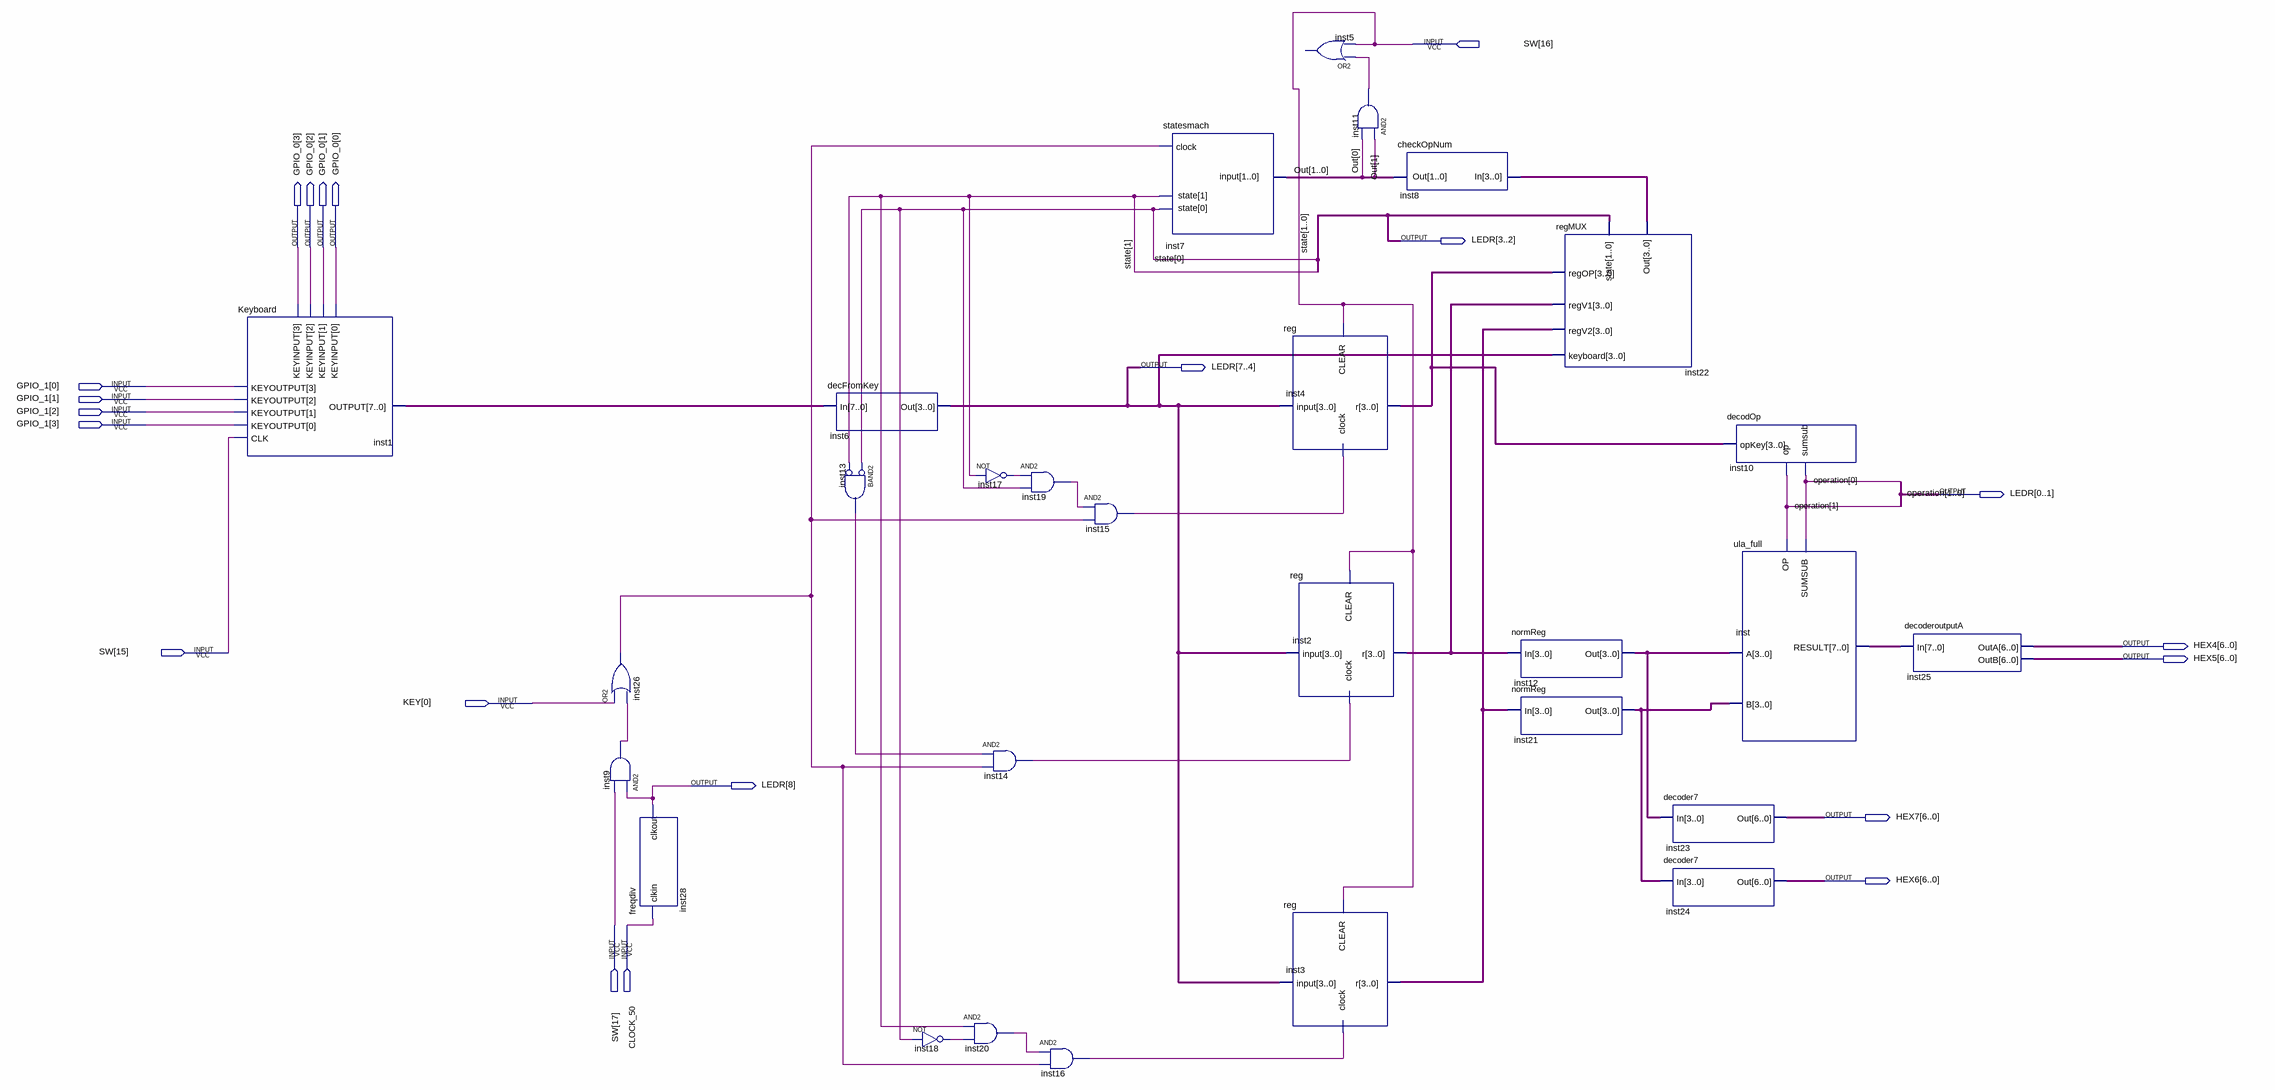
[diagram p0: schematic sheet]
// Quartus schematic calcFPGA.bdf as structural Verilog: 28 symbols, 21 pins
module calcFPGA (
  input  [17:15] SW,
  input  [3:0] GPIO_1,
  input  [0:0] KEY,
  input  CLOCK_50,
  output [0:8] LEDR,
  output [3:0] GPIO_0,
  output [6:0] HEX4,
  output [6:0] HEX5,
  output [6:0] HEX7,
  output [6:0] HEX6
);

  wire inst9_out, inst11_out, inst13_out, inst14_out, inst15_out, inst16_out, inst17_out, inst18_out,
       inst19_out, inst20_out, inst26_out;
  wire [1:0] Out;
  wire [3:0] inst2_r, inst3_r, inst4_r, inst12_out, inst21_out, inst22_out;
  wire [7:0] inst1_output, inst_result;

  Keyboard inst1 (
    .CLK(SW[15]), .KEYOUTPUT({GPIO_1[0], GPIO_1[1], GPIO_1[2], GPIO_1[3]}), .KEYINPUT(GPIO_0),
    .OUTPUT(inst1_output));
  or inst26 (inst26_out, KEY[0], inst9_out);
  and inst9 (inst9_out, LEDR[8], SW[17]);
  freqdiv inst28 (.clkin(CLOCK_50), .clkout(LEDR[8]));
  decFromKey inst6 (.In(inst1_output), .Out({LEDR[7], LEDR[6], LEDR[5], LEDR[4]}));
  and inst13 (inst13_out, ~LEDR[2], ~LEDR[3]);  // BAND2
  not inst18 (inst18_out, LEDR[2]);
  not inst17 (inst17_out, LEDR[3]);
  and inst14 (inst14_out, inst13_out, inst26_out);
  and inst20 (inst20_out, LEDR[3], inst18_out);
  and inst19 (inst19_out, inst17_out, LEDR[2]);
  and inst16 (inst16_out, inst20_out, inst26_out);
  and inst15 (inst15_out, inst19_out, inst26_out);
  statesmach inst7 (.\input (Out), .clock(inst26_out), .state({LEDR[3], LEDR[2]}));
  \reg  inst4 (.CLEAR(SW[16]), .\input ({LEDR[7], LEDR[6], LEDR[5], LEDR[4]}), .clock(inst15_out), .r(inst4_r));
  \reg  inst2 (.CLEAR(SW[16]), .\input ({LEDR[7], LEDR[6], LEDR[5], LEDR[4]}), .clock(inst14_out), .r(inst2_r));
  \reg  inst3 (.CLEAR(SW[16]), .\input ({LEDR[7], LEDR[6], LEDR[5], LEDR[4]}), .clock(inst16_out), .r(inst3_r));
  // OR2 inst5 has open pins: IN1=inst11_out, IN2=SW[16], OUT=open
  and inst11 (inst11_out, Out[1], Out[0]);
  checkOpNum inst8 (.In(inst22_out), .Out(Out));
  regMUX inst22 (
    .state({LEDR[3], LEDR[2]}), .regV1(inst2_r), .regV2(inst3_r), .regOP(inst4_r),
    .keyboard({LEDR[7], LEDR[6], LEDR[5], LEDR[4]}), .Out(inst22_out));
  normReg inst12 (.In(inst2_r), .Out(inst12_out));
  normReg inst21 (.In(inst3_r), .Out(inst21_out));
  decoder7 inst23 (.In(inst12_out), .Out(HEX7));
  decoder7 inst24 (.In(inst21_out), .Out(HEX6));
  decodOp inst10 (.opKey(inst4_r), .sumsub(LEDR[1]), .op(LEDR[0]));
  ula_full inst (.OP(LEDR[0]), .A(inst12_out), .B(inst21_out), .SUMSUB(LEDR[1]), .RESULT(inst_result));
  decoderoutputA inst25 (.In(inst_result), .OutA(HEX4), .OutB(HEX5));

  // Other names for the same wires on the sheet: operation[1:0] = LEDR[0:1]; state[1:0] = {LEDR[3], LEDR[2]}
endmodule
